# Altium schematic sheet MCU.SchDoc
size A
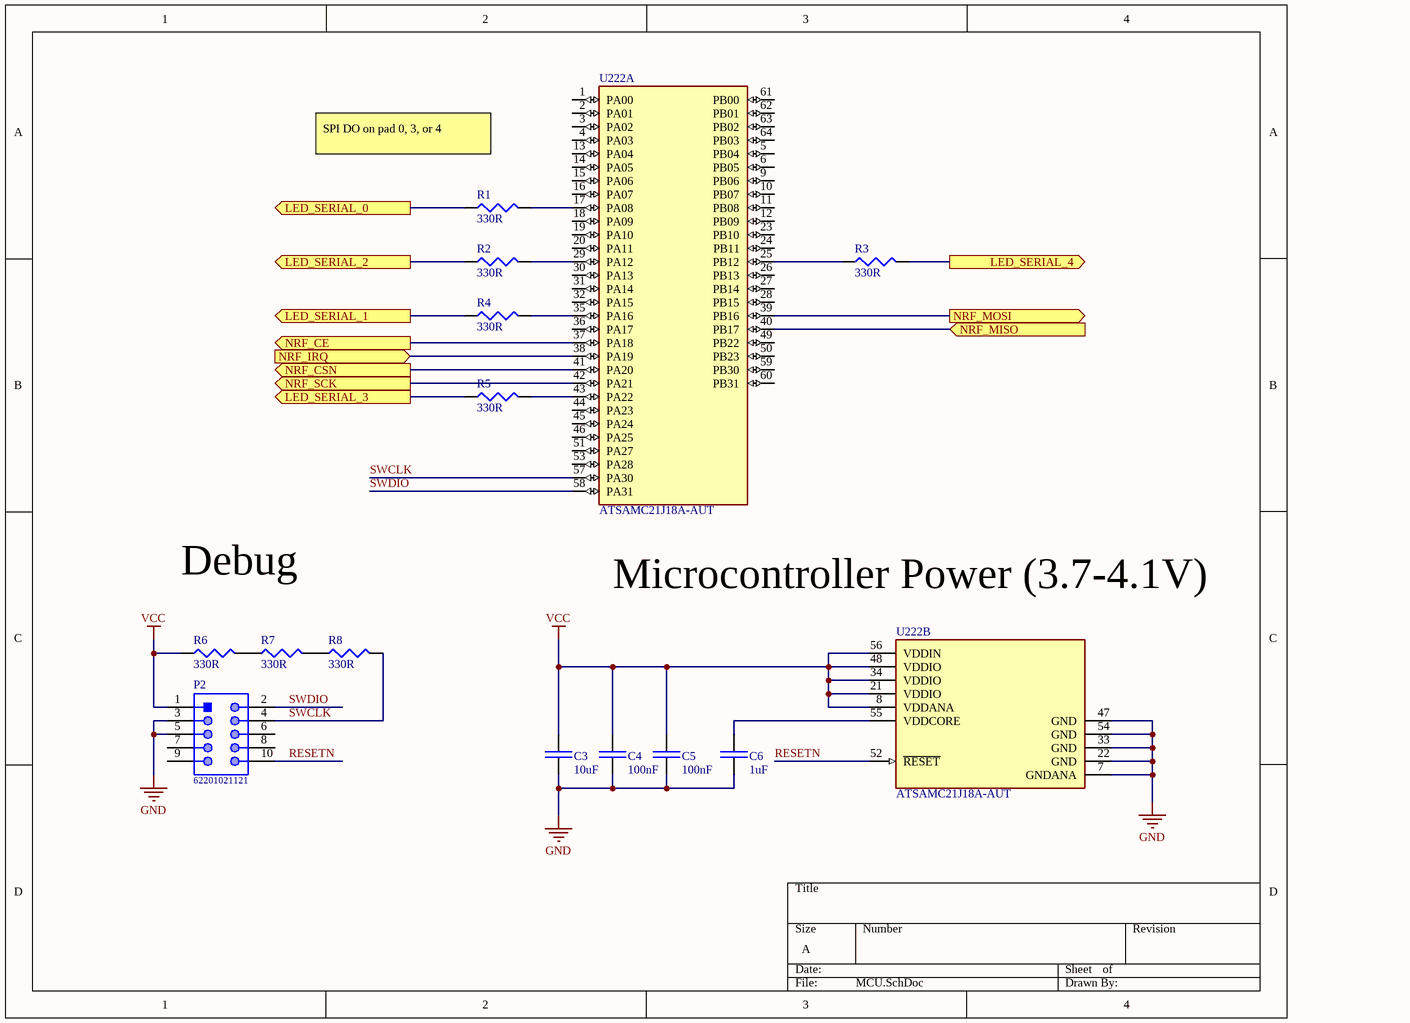
[diagram p0: MCU.SchDoc]

## Parts
C3  10uF  [CAPC2012X14M]
C4  100nF  [CAPC1608X09M]
C5  100nF  [CAPC1608X09M]
C6  1uF  [CAPC2012X14M]
P2  62201021121  [62201021121]
R1  330R  [RESC1608X06M]
R2  330R  [RESC1608X06M]
R3  330R  [RESC1608X06M]
R4  330R  [RESC1608X06M]
R5  330R  [RESC1608X06M]
R6  330R  [RESC1608X06M]
R7  330R  [RESC1608X06M]
R8  330R  [RESC1608X06M]
U222  ATSAMC21J18A-AUT  [TQFP64]  (parts A,B of 2)

## Ports
LED_SERIAL_0 (out), LED_SERIAL_1 (out), LED_SERIAL_2 (out), LED_SERIAL_3 (out), LED_SERIAL_4 (out), NRF_CE (out), NRF_CSN (out), NRF_IRQ (in), NRF_MISO (in), NRF_MOSI (out), NRF_SCK (out)

## Nets
GND: C3.2 C4.2 C5.2 C6.2 P2.3 P2.5 U222.7(GNDANA) U222.22(GND) U222.33(GND) U222.47(GND) U222.54(GND)
VCC: C3.1 C4.1 C5.1 P2.1 R6.1 U222.8(VDDANA) U222.21(VDDIO) U222.34(VDDIO) U222.48(VDDIO) U222.56(VDDIN)
LED_SERIAL_0: R1.1 ; port LED_SERIAL_0
LED_SERIAL_1: R4.1 ; port LED_SERIAL_1
LED_SERIAL_2: R2.1 ; port LED_SERIAL_2
LED_SERIAL_3: R5.1 ; port LED_SERIAL_3
LED_SERIAL_4: R3.2 ; port LED_SERIAL_4
NRF_CE: U222.37(PA18) ; port NRF_CE
NRF_CSN: U222.41(PA20) ; port NRF_CSN
NRF_IRQ: U222.38(PA19) ; port NRF_IRQ
NRF_MISO: U222.40(PB17) ; port NRF_MISO
NRF_MOSI: U222.39(PB16) ; port NRF_MOSI
NRF_SCK: U222.42(PA21) ; port NRF_SCK
RESETN: P2.10 U222.52(~{RESET})
SWCLK: P2.4 R8.2 U222.57(PA30)
SWDIO: P2.2 U222.58(PA31)
NetC6_1: C6.1 U222.55(VDDCORE)
NetR1_2: R1.2 U222.17(PA08)
NetR2_2: R2.2 U222.29(PA12)
NetR3_1: R3.1 U222.25(PB12)
NetR4_2: R4.2 U222.35(PA16)
NetR5_2: R5.2 U222.43(PA22)
NetR6_2: R6.2 R7.1
NetR7_2: R7.2 R8.1

Not connected (* = marked no-connect by the designer): P2 6 7 8 9; U222 1(PA00) 2(PA01) 3(PA02) 4(PA03) 5(PB04) 6(PB05) 9(PB06) 10(PB07) 11(PB08) 12(PB09) 13(PA04) 14(PA05) 15(PA06) 16(PA07) 18(PA09) 19(PA10) 20(PA11) 23(PB10) 24(PB11) 26(PB13) 27(PB14) 28(PB15) 30(PA13) 31(PA14) 32(PA15) 36(PA17) 44(PA23) 45(PA24) 46(PA25) 49(PB22) 50(PB23) 51(PA27) 53(PA28) 59(PB30) 60(PB31) 61(PB00) 62(PB01) 63(PB02) 64(PB03)

## Notes on the sheet
- SPI DO on pad 0, 3, or 4
- Debug
- Microcontroller Power (3.7-4.1V)

## Library data of the parts
C3 = CL21A106KAYNNNE: MULTILAYER CERAMIC CAPACITORS MLCC - SMD/SMT 10UF 25V 0805 ROHS; LCSC Part #: C15850; Value: 10uF
C4 C5 = CC0603KRX7R9BB104_1: MULTILAYER CERAMIC CAPACITORS MLCC - SMD/SMT 100NF 50V 0603 ROHS; Value: 100nF; LCSC Part #: C14663
C6 = CL21B105KBFNNNE_1: MULTILAYER CERAMIC CAPACITORS MLCC - SMD/SMT 1UF 50V 0805 ROHS; Value: 1uF; LCSC Part #: C28323
P2 = CMP-1502-00948-1: THT Vertical Pin Header WR-PHD, Pitch 1.27 mm, Dual Row, 10 pins; Manufacturer: Wurth Elektronik; Rated Current: 1A; Pin Number: 10; Working Voltage: 100VAC; Contact Resistance: 20mOhm; Withstanding Voltage: 500VAC; Pitch: 1.27mm; Gender: Male; Mounting Technology: THT; Manufacturer URL: http://www.we-online.de; Package Reference: 62201021121; Row Number: Dual; Datasheet URL: https://katalog.we-online.de/em/datasheet/62201021121.pdf; Publisher: WurthElektronik; Packaging: Box; Operating Temperature: -40to105degC; Orientation: Vertical; Part Number: 62201021121
R1-R8 = 0603WAF3300T5E: CHIP RESISTOR - SURFACE MOUNT 330OHMS ±1% 1/10W 0603 ROHS; Value: 330R; LCSC Part #: C23138
U222 = CMP-06276-000065-1: IC MCU 32BIT 256KB FLASH 64TQFP; Interface: I2C; Peripherals: Brown-out Detect/Reset; Number of I/Os: 52; Oscillator Type: Internal; Core Architecture: ARM; Frequency: 48MHz; Memory Type: FLASH; Min Operating Temperature: -40°C; Memory Size: 256KB; Case/Package: TQFP; Packaging: Cut Tape; Max Operating Temperature: 85°C